# EAGLE design Logger ver1.0.0 (EAGLE 9.6.2)
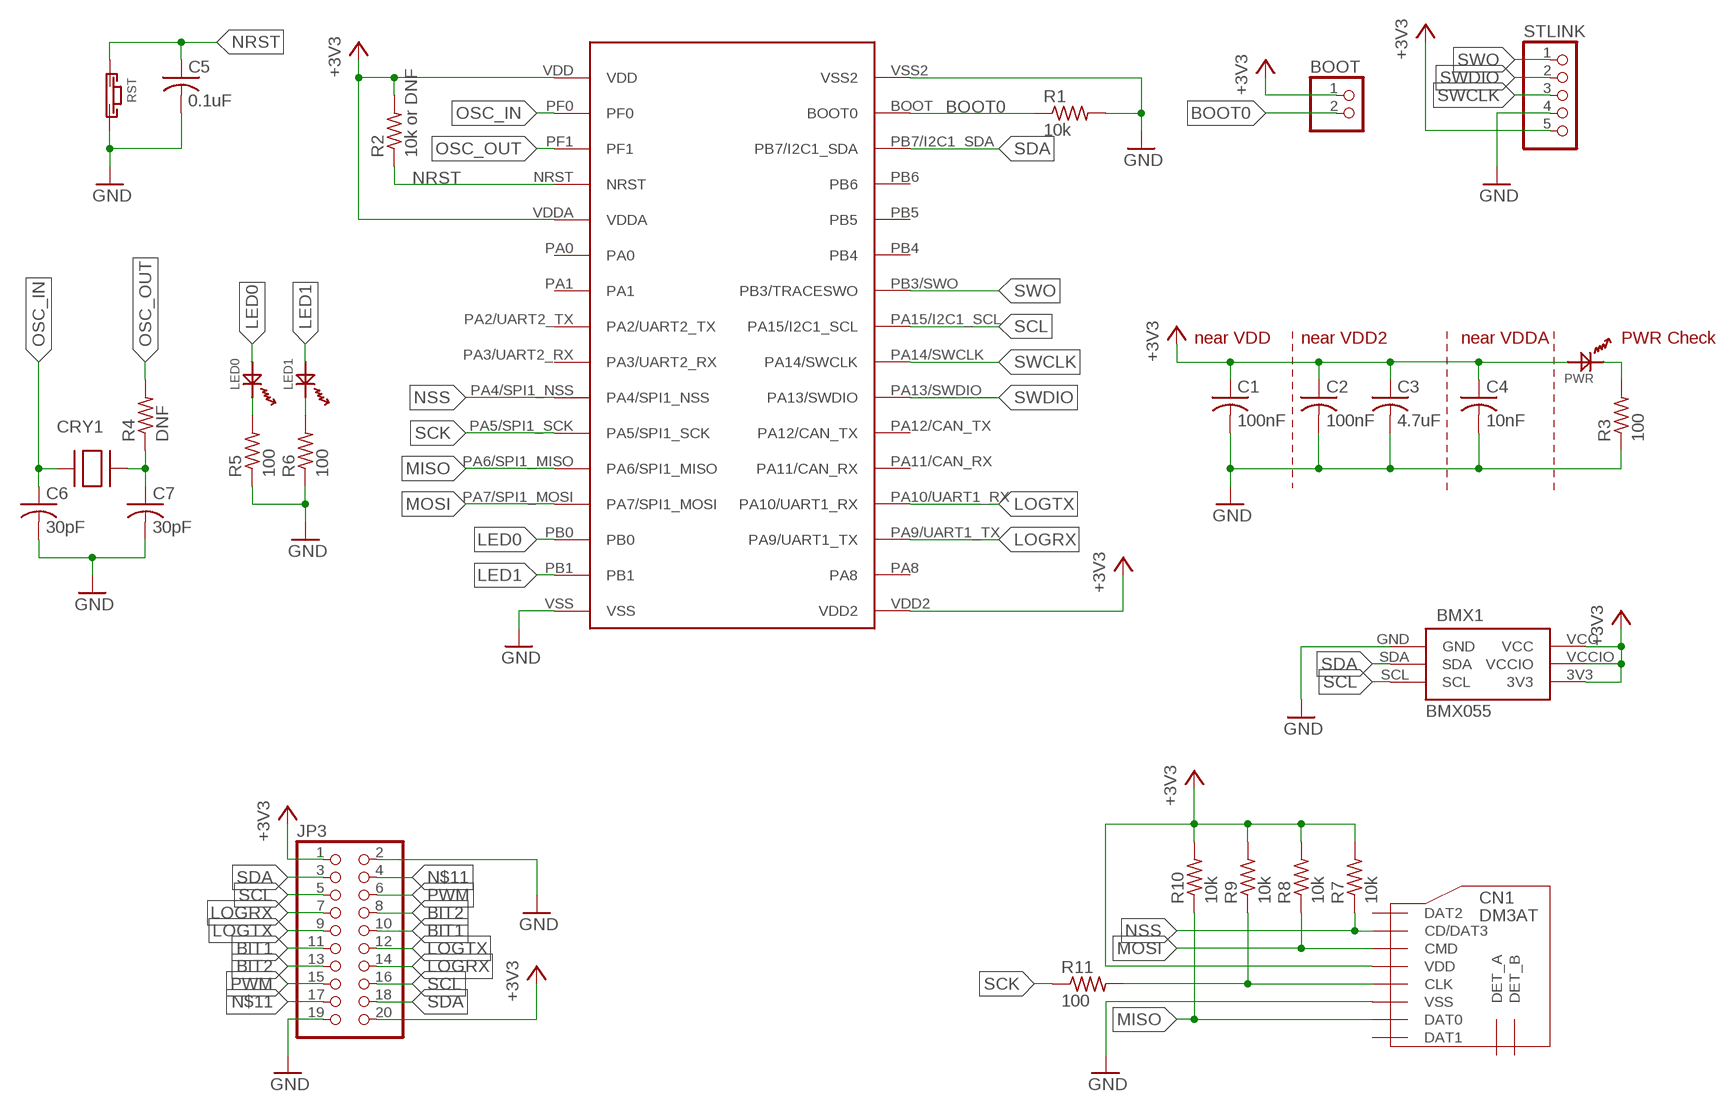
[diagram p0: schematic, sheet 1]

## Parts
BMX1  BMX055  [BMX055]
BOOT  PINHD-1X2/90  [1X02/90]
C1  100nF  C-USC1608  [C1608]
C2  100nF  C-USC1608  [C1608]
C3  4.7uF  C-USC1608  [C1608]
C4  10nF  C-USC1608  [C1608]
C5  0.1uF  C-USC1608  [C1608]
C6  30pF  C-USC1608  [C1608]
C7  30pF  C-USC1608  [C1608]
CN1  DM3AT  [DM3AT]
CRY1  8MHZ  [CRYSTAL]
JP3  PINHD-2X10/90  [2X10/90]
LED0  OSXX1608C1A  [OSXX1608C1A]
LED1  OSXX1608C1A  [OSXX1608C1A]
PWR  OSXX1608C1A  [OSXX1608C1A]
R1  10k  R-US_R0603  [R0603]
R2  10k or DNF  R-US_R0603  [R0603]
R3  100  R-US_R0603  [R0603]
R4  DNF  R-US_R0603  [R0603]
R5  100  R-US_R0603  [R0603]
R6  100  R-US_R0603  [R0603]
R7  10k  R-US_R0603  [R0603]
R8  10k  R-US_R0603  [R0603]
R9  10k  R-US_R0603  [R0603]
R10  10k  R-US_R0603  [R0603]
R11  100  R-US_R0603  [R0603]
RST  TVAF06-A020B-R  [TVAF06-A020B-R]
STLINK  PINHD-1X5/90  [1X05/90]
U$1  STM32F303K8  [STM32F303K8]

## Nets
+3V3: BMX1.3V3 BMX1.VCC BMX1.VCCIO BOOT.1 C1.1 C2.1 C3.1 C4.1 CN1.VDD JP3.1 JP3.20 PWR.AN R2.2 R7.2 R8.2 R9.2 R10.2 STLINK.5 U$1.VDD U$1.VDD2 U$1.VDDA
BIT1: JP3.10 JP3.11
BIT2: JP3.8 JP3.13
BOOT0: BOOT.2 R1.1 U$1.BOOT(BOOT0)
GND: BMX1.GND C1.2 C2.2 C3.2 C4.2 C5.2 C6.2 C7.2 CN1.VSS JP3.2 JP3.19 R1.2 R3.1 R5.1 R6.1 RST.P$2 STLINK.4 U$1.VSS U$1.VSS2
LED0: LED0.AN U$1.PB0
LED1: LED1.AN U$1.PB1
LOGRX: JP3.7 JP3.14 U$1.PA9/UART1_TX
LOGTX: JP3.9 JP3.12 U$1.PA10/UART1_RX
MISO: CN1.DAT0 R10.1 U$1.PA6/SPI1_MISO
MOSI: CN1.CMD R8.1 U$1.PA7/SPI1_MOSI
N$1: PWR.CT R3.2
N$2: LED0.CT R5.2
N$3: C7.1 CRY1.P$2 R4.1
N$4: LED1.CT R6.2
N$7: CN1.CLK R9.1 R11.2
N$11: JP3.4 JP3.17
NRST: C5.1 R2.1 RST.P$1 U$1.NRST
NSS: CN1.CD/DAT3 R7.1 U$1.PA4/SPI1_NSS
OSC_IN: C6.1 CRY1.P$1 U$1.PF0
OSC_OUT: R4.2 U$1.PF1
PWM: JP3.6 JP3.15
SCK: R11.1 U$1.PA5/SPI1_SCK
SCL: BMX1.SCL JP3.5 JP3.16 U$1.PA15/I2C1_SCL
SDA: BMX1.SDA JP3.3 JP3.18 U$1.PB7/I2C1_SDA
SWCLK: STLINK.3 U$1.PA14/SWCLK
SWDIO: STLINK.2 U$1.PA13/SWDIO
SWO: STLINK.1 U$1.PB3/SWO(PB3/TRACESWO)
Unconnected: CN1.DAT1 CN1.DAT2 CN1.DET_A CN1.DET_B U$1.PA0 U$1.PA1 U$1.PA2/UART2_TX U$1.PA3/UART2_RX U$1.PA8 U$1.PA11/CAN_RX U$1.PA12/CAN_TX U$1.PB4 U$1.PB5 U$1.PB6

## Notes on the sheet
- near VDD | near VDD2 | near VDDA | PWR Check

## Library data of the parts
BMX1 = BMX055:BMX055
BOOT = pinhead:PINHD-1X2: PIN HEADER
C1-C7 = rcl:C-US: CAPACITOR, American symbol; SPICEPREFIX: C
CN1 = microSD:DM3AT
CRY1 = Crystal:8MHZ
JP3 = pinhead:PINHD-2X10: PIN HEADER
LED0 LED1 PWR = Chip LED:OSXX1608C1A
R1-R11 = rcl:R-US_: RESISTOR, American symbol; SPICEPREFIX: R
RST = Tact switch:TVAF06-A020B-R
STLINK = pinhead:PINHD-1X5: PIN HEADER
U$1 = STM32F303K8:STM32F303K8

## Board
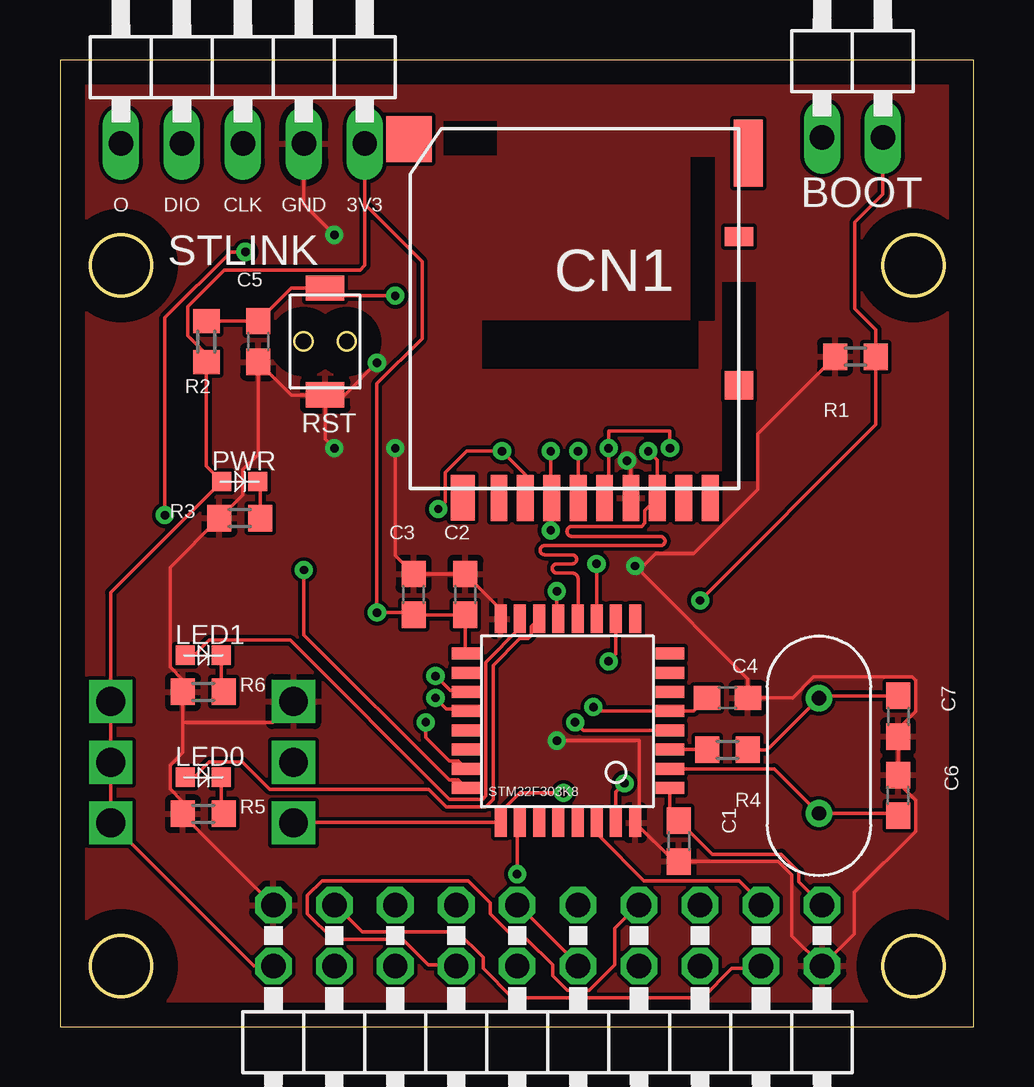
[diagram p1: board, top side]
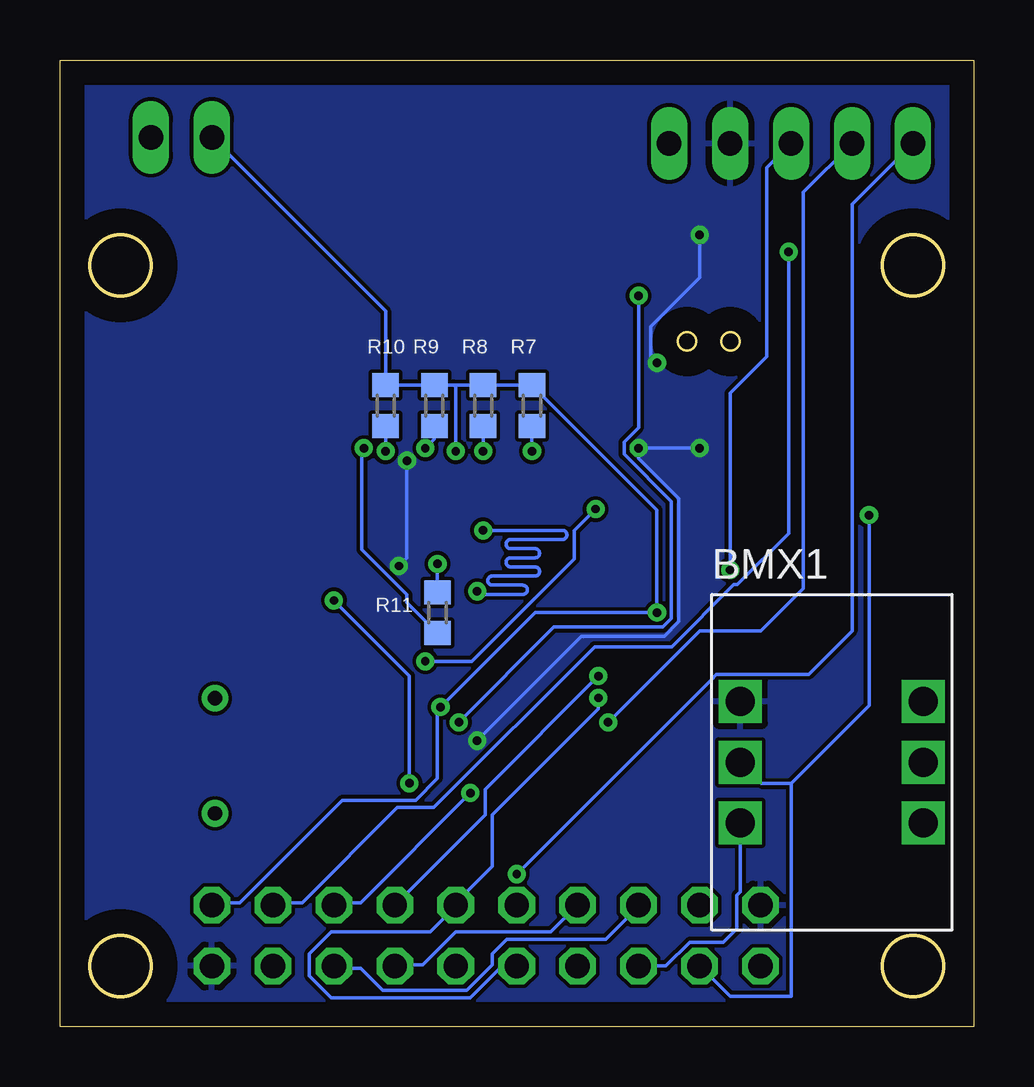
[diagram p2: board, bottom side, seen from below]

Size 38.08 x 40.31 mm. Coordinates in mm from the lower left corner, seen from the top.
Outline: 0,0 38.08,0 38.08,40.31 0,40.31 0,0
Outline: circle at 35.56,2.54 radius 1.27
Outline: circle at 2.54,2.54 radius 1.27
Outline: circle at 35.56,31.75 radius 1.27
Outline: circle at 2.54,31.75 radius 1.27
Copper layers (1*16): Top 0.035mm / dielectric 1.5mm / Bottom 0.035mm
Design rules "default": minimum track width 6mil, minimum drill 0.35mm, track to track 6mil, track to pad 6mil, pad to pad 6mil, via to via 6mil, smd to smd 6mil, copper to edge 40mil, drill to drill 6mil, minimum pad ring 10mil, minimum via ring 8mil, stop-mask expansion 4mil, vias tented up to drill 0mil, thermal gap 10mil

### Footprints (pad centres in the part's own frame; a part is rotated, then mirrored left to right if it is on the bottom)
BMX055 = drill 1.2 pad 1.5 square: 3V3 8.81,-9.53; GND 1.19,-4.46; SCL 1.19,-9.53; SDA 1.19,-7; VCC 8.81,-4.46; VCCIO 8.81,-7
1X02/90 = drill 1.016 long: 1 -1.27,-3.81; 2 1.27,-3.81
C1608 = smd 1.1 x 1: 1 -0.85,0; 2 0.85,0
DM3AT = smd 0.7 x 1.9: CD/DAT3 2.2,6.4; CLK -1.1,6.4; CMD 1.1,6.4; DAT0 -3.3,6.4; DAT1 -4.4,6.4; DAT2 3.3,6.4; DET_B -5.5,6.4; VDD 0,6.4; VSS -2.2,6.4 | smd 1.2 x 0.8: DET_A -6.7,-4.5 | smd 1 x 1.9: P$9 4.8,6.381 | smd 1.2 x 1.2: P$11 -6.7,1.7 | smd 1.2 x 2.8: P$13 -7.081,-7.973 | smd 1.9 x 1.9: P$14 7.054,-8.562
CRYSTAL = drill 0.6: P$1 2.4,0; P$2 -2.4,0
2X10/90 = drill 1.016 octagon: 1 -11.43,-6.35; 2 -11.43,-3.81; 3 -8.89,-6.35; 4 -8.89,-3.81; 5 -6.35,-6.35; 6 -6.35,-3.81; 7 -3.81,-6.35; 8 -3.81,-3.81; 9 -1.27,-6.35; 10 -1.27,-3.81; 11 1.27,-6.35; 12 1.27,-3.81; 13 3.81,-6.35; 14 3.81,-3.81; 15 6.35,-6.35; 16 6.35,-3.81; 17 8.89,-6.35; 18 8.89,-3.81; 19 11.43,-6.35; 20 11.43,-3.81
OSXX1608C1A = smd 0.8 x 0.8: AN -0.75,0; CT 0.75,0
R0603 = smd 1 x 1.1: 1 -0.85,0; 2 0.85,0
TVAF06-A020B-R = smd 1.6 x 1.05: P$1 0,2.225; P$2 0,-2.225
1X05/90 = drill 1.016 long: 1 -5.08,-3.81; 2 -2.54,-3.81; 3 0,-3.81; 4 2.54,-3.81; 5 5.08,-3.81
STM32F303K8 = smd 0.5 x 1.2: BOOT 1.6,8.5; PA3/UART2_RX 0.8,0; PA4/SPI1_NSS 1.6,0; PA5/SPI1_SCK 2.4,0; PA6/SPI1_MISO 3.2,0; PA7/SPI1_MOSI 4,0; PA15/I2C1_SCL 6.4,8.5; PB0 4.8,0; PB1 5.6,0; PB3/SWO 5.6,8.5; PB4 4.8,8.5; PB5 4,8.5; PB6 3.2,8.5; PB7/I2C1_SDA 2.4,8.5; VSS 0.8,8.5; VSS2 6.4,0 | smd 1.2 x 0.5: NRST -0.65,4.65; PA0 -0.65,3.05; PA1 -0.65,2.25; PA2/UART2_TX -0.65,1.45; PA8 7.85,2.25; PA9/UART1_TX 7.85,3.05; PA10/UART1_RX 7.85,3.85; PA11/CAN_RX 7.85,4.65; PA12/CAN_TX 7.85,5.45; PA13/SWDIO 7.85,6.25; PA14/SWCLK 7.85,7.05; PF0 -0.65,6.25; PF1 -0.65,5.45; VDD -0.65,7.05; VDD2 7.85,1.45; VDDA -0.65,3.85

### Placement (x,y rotation side)
BMX1  10.92,18.03 0 bottom
BOOT  33.02,40.89 0 top
C1  25.78,7.75 270 top
C2  16.89,18.03 90 top
C3  14.73,18.03 90 top
C4  27.81,13.72 0 top
C5  8.25,28.57 270 top
C6  34.92,9.65 90 top
C7  34.92,12.95 270 top
CN1  21.59,28.45 180 top
CRY1  31.62,11.3 270 top
JP3  20.32,-1.27 180 top
LED0  5.97,10.41 0 top
LED1  5.97,15.49 0 top
PWR  7.49,22.73 0 top
R1  33.15,27.94 180 top
R2  6.1,28.57 270 top
R3  7.49,21.21 0 top
R4  27.81,11.56 180 top
R5  5.97,8.89 0 top
R6  5.97,13.97 0 top
R7  18.41,25.91 90 bottom
R8  20.45,25.91 90 bottom
R9  22.48,25.91 90 bottom
R10  24.51,25.91 90 bottom
R11  22.35,17.27 270 bottom
RST  11.05,28.57 0 top
STLINK  7.62,40.64 0 top
U$1  24.77,17.02 180 top

### Tracks (layer width: path | path; a pad name or v marks a point on that pad's centre or on a via)
+3V3  (via drill 0.35)
  Top 0.152: CN1.VDD v21.59,24 | U$1.VDD2 16.89,15.59 C2.1 C3.1 14.64,17.27 v13.21,17.27 13.21,26.83 15.08,28.7 15.08,31.91 12.7,34.29 | JP3.20 8.08,2.54 BMX1.3V3 BMX1.VCCIO BMX1.VCC 2.11,18.1 PWR.AN 6.1,23.38 R2.2 6.1,28.05 5.32,28.83 5.32,30.02 6.85,31.55 12.5,31.55 12.7,31.75 12.7,34.29 | C4.1 26.41,13.17 U$1.VDDA 22.39,13.17 v22.23,13.34 | U$1.VDD 25.41,8.96 C1.1 27.18,7.2 30.06,7.2 30.78,6.48 30.78,6.04 JP3.1 | STLINK.5 12.7,34.29
  Bottom 0.152: v21.59,24 21.59,26.67 21.68,26.76 R9.2 | R9.2 R10.2 24.51,29.84 BOOT.1 | R9.2 R8.2 R7.2 13.21,21.55 v13.21,17.27 18.29,17.27 v22.23,13.34 22.35,13.26 22.35,10.36 23.27,9.45 26.31,9.45 30.58,5.18 31.65,5.18 JP3.1
BIT1
  Top 0.152: JP3.11 19.15,5.03 21.59,2.59 JP3.10
BIT2
  Bottom 0.152: JP3.13 17.63,3.96 21.59,3.96 22.96,2.59 24.03,2.59 JP3.8
BOOT0  (via drill 0.35)
  Top 0.152: BOOT.2 34.29,34.72 33.12,33.55 33.12,29.95 34,29.08 R1.1 34,25.11 v26.67,17.78 | v23.52,10.16 23.16,9.8 U$1.BOOT
  Bottom 0.152: v26.67,17.78 23.52,14.63 v23.52,10.16
GND  (via drill 0.35)
  Top 0.152: U$1.VSS2 18.37,17.41 C2.2 C3.2 13.97,19.65 v13.97,24.13 | 5.12,12.7 R6.1 5.12,14.47 4.59,15 4.59,19.16 R3.1 7.61,22.18 7.61,23.23 8.25,23.87 C5.2 9.63,26.35 RST.P$2 | 5.12,12.7 5.12,11.44 4.59,10.91 4.59,9.92 5.12,9.39 R5.1 5.12,8.85 JP3.19 | BMX1.GND 8.86,12.7 5.12,12.7 | CN1.VSS 23.79,23.44 v23.62,23.61 | v23.96,19.22 24.13,19.05 | 24.13,19.05 28.66,14.52 C4.2 30.53,13.72 31.4,14.58 35.52,14.58 35.65,14.45 35.65,13.16 34.92,12.43 C7.2 C6.2 34.92,10.18 35.65,9.45 35.65,8.16 33.1,5.6 33.1,3.89 JP3.2 30.48,3.81 30.48,6.35 29.93,6.9 C1.2 25.59,6.9 U$1.VSS 24.13,8.68 24.13,11.94 v20.7,11.94 | R1.2 29.07,24.71 29.07,22.4 26.4,19.74 24.82,19.74 24.13,19.05 | STLINK.4 10.16,34.29 v11.43,33.02 | v13.21,27.69 11.87,26.35 RST.P$2 | v11.43,24.13 11.05,24.51 RST.P$2
  Bottom 0.152: v23.62,23.61 23.62,19.56 v23.96,19.22 | v13.21,27.69 13.47,27.95 13.47,29.2 11.43,31.24 v11.43,33.02 | v11.43,24.13 v13.97,24.13 13.97,23.7 12.3,22.03 12.3,16.89 12.91,16.28 16.36,16.28 v20.7,11.94
  pour Bottom: -1.27,40.64 39.37,40.64 39.37,-1.27 -1.27,-1.27
  pour Top: -1.27,40.64 39.37,40.64 39.37,-1.27 -1.27,-1.27
LED0
  Top 0.152: LED0.AN 5.6,10.41 6.22,11.04 7.6,11.04 8.74,9.9 15.37,9.9 16.09,9.19 17.74,9.19 18.05,9.5 18.05,15.08 19.16,16.19 19.51,16.19 19.64,16.32 19.64,16.7 U$1.PB0
LED1
  Top 0.152: LED1.AN 5.6,15.49 6.22,16.12 9.59,16.12 16.22,9.49 17.61,9.49 17.74,9.62 17.74,15.2 19.16,16.62 U$1.PB1
LOGRX  (via drill 0.35)
  Top 0.152: v15.65,14.63 16.26,14.02 16.87,14.02 U$1.PA9/UART1_TX | JP3.14 16.41,2.59 15.34,2.59 14.27,3.66 11.38,3.66 10.31,4.72 10.31,5.49 10.92,6.1 17.02,6.1 17.93,5.18 17.93,4.72 19,3.66 19.46,3.66 20.52,2.59 20.52,2.13 21.13,1.52 22.05,1.52 23.11,2.59 23.11,4.12 24.03,5.03 JP3.7
  Bottom 0.152: v15.65,14.63 20.37,9.91 20.37,8.84 JP3.7
LOGTX  (via drill 0.35)
  Top 0.152: v15.65,13.72 16.1,13.26 16.87,13.26 U$1.PA10/UART1_RX
  Bottom 0.152: v15.65,13.72 15.65,13.26 20.07,8.84 20.07,6.71 21.59,5.18 JP3.9 21.59,5.03 22.66,3.96 26.77,3.96 27.69,3.05 27.69,2.13 26.77,1.22 20.98,1.22 19.76,2.44 19.15,2.44 JP3.12
MISO  (via drill 0.35)
  Top 0.152: v24.51,24 24.89,23.62 CN1.DAT0 24.37,21.53 24.37,21 24.23,20.87 21.34,20.87 arc180 21.34,20.45 25.02,20.45 arc-180 25.02,20.07 20.19,20.07 arc180 20.19,19.68 21.34,19.68 arc-180 21.34,19.3 20.7,19.3 arc180 20.7,18.92 21.34,18.92 arc-90 21.59,18.67 21.59,17.04 U$1.PA6/SPI1_MISO
  Bottom 0.152: v24.51,24 R10.1
MOSI  (via drill 0.35)
  Top 0.152: v20.45,24 20.45,22.09 CN1.CMD 20.49,20.74 v20.45,20.7 | v20.7,18.16 20.7,17.08 U$1.PA7/SPI1_MOSI
  Bottom 0.152: v20.45,24 R8.1 | v20.45,20.7 17.14,20.7 arc180 17.14,20.32 19.3,20.32 arc-180 19.3,19.94 18.29,19.94 arc180 18.29,19.56 19.3,19.56 arc-180 19.3,19.18 18.29,19.18 arc180 18.29,18.8 20.07,18.8 arc-180 20.07,18.41 18.8,18.41 arc180 18.8,18.03 20.57,18.03 v20.7,18.16
N$1
  Top 0.152: PWR.CT 8.34,22.63 R3.2
N$2
  Top 0.152: R5.2 6.72,8.99 LED0.CT
N$3
  Top 0.152: R4.1 29.48,11.56 CRY1.P$2 31.72,13.8 C7.1
N$4
  Top 0.152: R6.2 6.72,14.07 LED1.CT
N$7  (via drill 0.35)
  Top 0.152: CN1.CLK 22.86,22.22 v22.86,24.13 22.86,24.83 25.4,24.83 25.4,24.15 v25.42,24.13
  Bottom 0.152: v22.86,24.13 22.48,24.51 R9.1 | R11.2 23.62,17.69 23.62,18.02 25.5,19.9 25.5,24.05 v25.42,24.13
N$11
  Top 0.152: JP3.4 29.21,2.44 27.99,2.44 26.77,1.22 18.85,1.22 17.63,2.44 17.63,2.9 16.56,3.96 12.6,3.96 11.53,5.03 JP3.17
NRST  (via drill 0.35)
  Top 0.152: R2.1 C5.1 9.63,30.8 RST.P$1 11.37,30.48 v13.97,30.48 | U$1.NRST 21.8,12.37 v21.46,12.7
  Bottom 0.152: v13.97,30.48 13.97,24.99 14.58,24.38 14.58,23.88 12.6,21.9 12.6,17.02 12.96,16.66 17.5,16.66 v21.46,12.7
NSS  (via drill 0.35)
  Top 0.152: CN1.CD/DAT3 19.39,23.03 v18.41,24 16.95,24 16.06,23.11 16.06,21.89 v15.76,21.59 | v22.86,15.24 23.16,15.54 U$1.PA4/SPI1_NSS
  Bottom 0.152: v18.41,24 R7.1 | v15.76,21.59 16.65,20.7 16.65,19.51 20.92,15.24 v22.86,15.24
OSC_IN
  Top 0.152: U$1.PF0 29.76,10.77 CRY1.P$1 34.82,8.9 C6.1
OSC_OUT
  Top 0.152: U$1.PF1 R4.2
PWM
  Bottom 0.152: JP3.6 26.62,2.44 25.55,2.44 24.64,1.52 21.13,1.52 20.07,2.59 20.07,3.05 19.46,3.66 15.34,3.66 13.97,5.03 JP3.15
SCK  (via drill 0.35)
  Top 0.152: U$1.PA5/SPI1_SCK 22.37,19.29 v22.35,19.3
  Bottom 0.152: R11.1 v22.35,19.3
SCL  (via drill 0.35)
  Top 0.152: BMX1.SCL 9.86,8.53 18.24,8.53 U$1.PA15/I2C1_SCL 18.39,8.53 18.39,8.99 19.15,9.75 v20.98,9.75
  Bottom 0.152: BMX1.SCL 9.73,5.64 9.88,5.49 9.88,4.09 10.44,3.53 11.84,3.53 12.83,2.54 JP3.16 | v20.98,9.75 25.55,5.18 26.62,5.18 JP3.5
SDA  (via drill 0.35)
  Top 0.152: U$1.PB7/I2C1_SDA 22.5,8.38 22.5,7.92 24.33,6.1 28.3,6.1 29.21,5.18 JP3.3 | v7.72,32.31 7.11,32.31 4.37,29.57 v4.37,21.34
  Bottom 0.152: BMX1.SDA 8.86,10.16 7.62,10.16 | 7.62,10.16 7.62,1.27 10.16,1.27 JP3.18 | v7.72,32.31 7.72,20.57 9.86,18.44 10.01,18.44 12.6,15.85 15.8,15.85 22.5,9.14 24.03,9.14 27.99,5.18 29.21,5.18 JP3.3 | v4.37,21.34 4.37,13.41 7.62,10.16
SWCLK  (via drill 0.35)
  Top 0.152: U$1.PA14/SWCLK 16.59,10.29 16.22,10.29 10.16,16.35 v10.16,19.05
  Bottom 0.152: v10.16,19.05 10.16,26.42 8.63,27.95 8.63,35.82 STLINK.3
SWDIO  (via drill 0.35)
  Top 0.152: U$1.PA13/SWDIO 16.59,11.09 16.22,11.09 15.24,12.07 v15.24,12.7
  Bottom 0.152: STLINK.2 7.11,34.8 7.11,18.29 8.89,16.51 11.43,16.51 v15.24,12.7
SWO  (via drill 0.35)
  Top 0.152: v19.05,6.37 19.05,8.4 U$1.PB3/SWO
  Bottom 0.152: STLINK.1 5.08,34.29 5.08,16.51 6.89,14.7 10.73,14.7 10.86,14.57 10.86,14.54 19.03,6.37 v19.05,6.37

### Text on the board
tNames: O | DIO | CLK | GND | 3V3